# EAGLE design elatus (EAGLE 6.1)
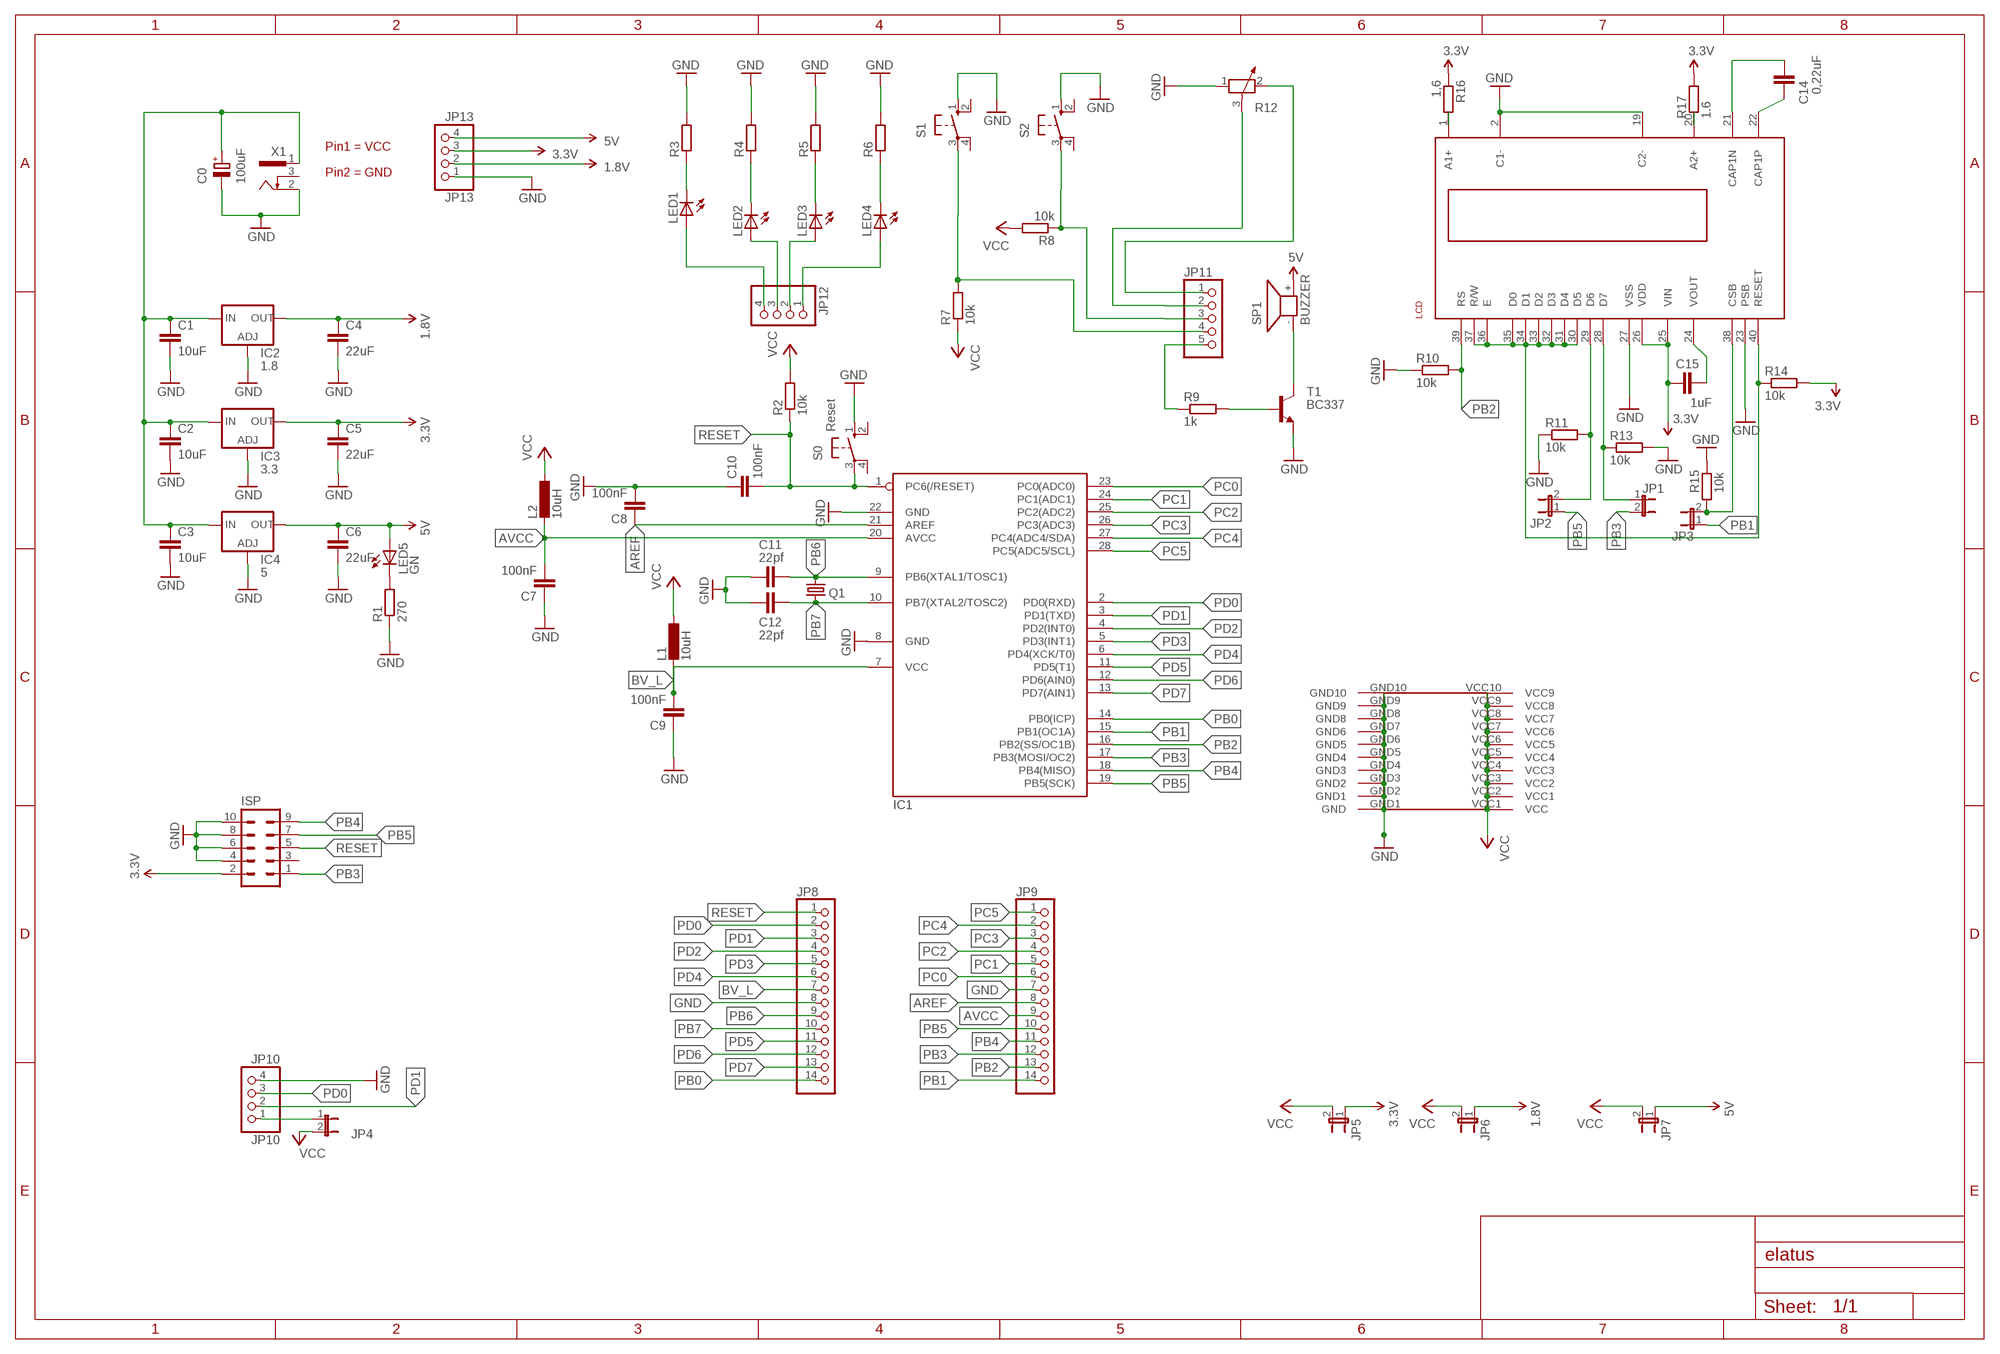
[diagram p0: schematic, sheet 1]

## Parts
C0  100uF  RCL_CPOL-EUE2.5-7  [RCL_E2,5-7]
C1  10uF  RCL_C-EU025-040X050  [RCL_C025-040X050]
C2  10uF  RCL_C-EU025-040X050  [RCL_C025-040X050]
C3  10uF  RCL_C-EU025-040X050  [RCL_C025-040X050]
C4  22uF  RCL_C-EU025-040X050  [RCL_C025-040X050]
C5  22uF  RCL_C-EU025-040X050  [RCL_C025-040X050]
C6  22uF  RCL_C-EU025-040X050  [RCL_C025-040X050]
C7  100nF  RCL_C-EU025-040X050  [RCL_C025-040X050]
C8  100nF  RCL_C-EU025-040X050  [RCL_C025-040X050]
C9  100nF  RCL_C-EU025-040X050  [RCL_C025-040X050]
C10  100nF  RCL_C-EU025-040X050  [RCL_C025-040X050]
C11  22pf  RESISTOR_C-EU050-024X044  [RESISTOR_C050-024X044]
C12  22pf  RESISTOR_C-EU050-024X044  [RESISTOR_C050-024X044]
C14  0,22uF  RCL_C-EU025-040X050  [RCL_C025-040X050]
C15  1uF  RCL_C-EU025-040X050  [RCL_C025-040X050]
IC1  MEGA8-P  [DIL28-3]
IC2  1.8  LM1117T-ADJ-V  [TO220V]
IC3  3.3  LM1117T-ADJ-V  [TO220V]
IC4  5  LM1117T-ADJ-V  [TO220V]
ISP  CON-HARTING-ML_ML10  [CON-HARTING-ML_ML10]
JP1  JP1E  [JP1]
JP2  JP1E  [JP1]
JP3  JP1E  [JP1]
JP4  JP1E  [JP1]
JP5  JP1E  [JP1]
JP6  JP1E  [JP1]
JP7  JP1E  [JP1]
JP8  PINHD-1X14  [1X14]
JP9  PINHD-1X14  [1X14]
JP10  JP10  PINHD-1X4  [1X04]
JP11  PINHD-1X5  [1X05]
JP12  PINHD-1X4  [1X04]
JP13  JP13  PINHD-1X4  [1X04]
L1  10uH  RCL_L-EU2200-12.7  [RCL_2200-12.7]
L2  10uH  RCL_L-EU2200-12.7  [RCL_2200-12.7]
LCD  -OPTO_DOGM  [-OPTO_DOGM]
LED1  LED_LED3MM  [LED_LED3MM]
LED2  LED_LED3MM  [LED_LED3MM]
LED3  LED_LED3MM  [LED_LED3MM]
LED4  LED_LED3MM  [LED_LED3MM]
LED5  GN  LED_LED3MM  [LED_LED3MM]
Q1  CRYSTAL_CRYSTALHC49U70  [CRYSTAL_HC49U70]
R1  270  R-EU_0207/10  [0207/10]
R2  10k  R-EU_0207/10  [0207/10]
R3  R-EU_0207/10  [0207/10]
R4  R-EU_0207/10  [0207/10]
R5  R-EU_0207/10  [0207/10]
R6  R-EU_0207/10  [0207/10]
R7  10k  R-EU_0207/10  [0207/10]
R8  10k  R-EU_0207/10  [0207/10]
R9  1k  R-EU_0207/10  [0207/10]
R10  10k  R-EU_0207/10  [0207/10]
R11  10k  R-EU_0207/10  [0207/10]
R12  POTENTIOMETER_PT-10  [PT-10]
R13  10k  R-EU_0207/10  [0207/10]
R14  10k  R-EU_0207/10  [0207/10]
R15  10k  R-EU_0207/10  [0207/10]
R16  1,6  R-EU_0207/10  [0207/10]
R17  1.6  R-EU_0207/10  [0207/10]
S0  Reset  SWITCH-OMRON_10-XX  [SWITCH-OMRON_B3F-10XX]
S1  SWITCH-OMRON_10-XX  [SWITCH-OMRON_B3F-10XX]
S2  SWITCH-OMRON_10-XX  [SWITCH-OMRON_B3F-10XX]
SP1  BUZZER  BUZZER_F/PMX04  [BUZZER_F/PMX04A]
T1  BC337  [TO92]
U$3  JP5  RASTER_2_45  [RASTER_2_54]
X1  CON-CONRAD_733980-62  [CON-CONRAD_733980-62]

## Nets
1.8V: C4.1 IC2.2(OUT) JP6.1 JP13.2
3.3V: C5.1 C15.2 IC3.2(OUT) ISP.2 JP5.1 JP13.3 LCD.25(VIN) LCD.26(VDD) R14.2 R16.1 R17.2
5V: C6.1 IC4.2(OUT) JP7.1 JP13.4 LED5.A SP1.+
AREF: C8.1 IC1.21(AREF) JP9.8
AVCC: C7.2 IC1.20(AVCC) JP9.9 L2.2
BV_L: C9.2 IC1.7(VCC) JP8.7 L1.2
GND: C0.- C1.2 C2.2 C3.2 C4.2 C5.2 C6.2 C7.1 C8.2 C9.1 C10.1 C11.1 C12.1 IC1.8(GND) IC1.22(GND) IC2.1(ADJ) IC3.1(ADJ) IC4.1(ADJ) ISP.4 ISP.6 ISP.8 ISP.10 JP8.8 JP9.7 JP10.4 JP13.1 LCD.2(C1-) LCD.19(C2-) LCD.23(PSB) LCD.27(VSS) R1.1 R3.2 R4.2 R5.2 R6.2 R10.1 R11.1 R12.1 R13.2 R15.2 S0.1(S) S1.1(S) S2.1(S) T1.1(E) U$3.GND1(GND) U$3.GND2(GND1) U$3.GND3(GND2) U$3.GND4(GND3) U$3.GND5(GND4) U$3.GND6(GND5) U$3.GND7(GND6) U$3.GND8 U$3.GND9 U$3.GND10 X1.2
N$1: LED1.K(C) R3.1
N$3: LED2.K(C) R4.1
N$5: JP11.2 R12.3
N$7: LED3.K(C) R5.1
N$9: JP11.4 R7.2 S1.3(P)
N$10: JP12.4 LED1.A
N$11: JP11.3 R8.1 S2.3(P)
N$12: LED4.K(C) R6.1
N$13: JP11.1 R12.2
N$14: JP12.3 LED2.A
N$15: JP2.2 LCD.29(D6) R11.2
N$16: JP1.1 LCD.28(D7) R13.1
N$18: LED5.K(C) R1.2
N$20: JP4.1 JP10.1
N$21: JP12.2 LED3.A
N$22: JP11.5 R9.1
N$24: JP12.1 LED4.A
N$25: SP1.- T1.3(C)
N$27: LCD.20(A2+) R17.1
N$28: C14.2 LCD.21(CAP1N)
N$29: C14.1 LCD.22(CAP1P)
N$30 [vcc_d]: C0.+ C1.1 C2.1 C3.1 IC2.3(IN) IC3.3(IN) IC4.3(IN) X1.1
N$31: LCD.1(A1+) R16.2
N$32: LCD.30(D5) LCD.31(D4) LCD.32(D3) LCD.33(D2) LCD.34(D1) LCD.35(D0) LCD.36(E) LCD.37(R/W) LCD.40(RESET) R14.1
N$34: R9.2 T1.2(B)
N$35: C15.1 LCD.24(VOUT)
N$37: JP3.2 LCD.38(CSB) R15.1
PB0: IC1.14(PB0(ICP)) JP8.14
PB1: IC1.15(PB1(OC1A)) JP3.1 JP9.14
PB2: IC1.16(PB2(SS/OC1B)) JP9.13 LCD.39(RS) R10.2
PB3: IC1.17(PB3(MOSI/OC2)) ISP.1 JP1.2 JP9.12
PB4: IC1.18(PB4(MISO)) ISP.9 JP9.11
PB5: IC1.19(PB5(SCK)) ISP.7 JP2.1 JP9.10
PB6: C11.2 IC1.9(PB6(XTAL1/TOSC1)) JP8.9 Q1.2
PB7: C12.2 IC1.10(PB7(XTAL2/TOSC2)) JP8.10 Q1.1
PC0: IC1.23(PC0(ADC0)) JP9.6
PC1: IC1.24(PC1(ADC1)) JP9.5
PC2: IC1.25(PC2(ADC2)) JP9.4
PC3: IC1.26(PC3(ADC3)) JP9.3
PC4: IC1.27(PC4(ADC4/SDA)) JP9.2
PC5: IC1.28(PC5(ADC5/SCL)) JP9.1
PD0: IC1.2(PD0(RXD)) JP8.2 JP10.3
PD1: IC1.3(PD1(TXD)) JP8.3 JP10.2
PD2: IC1.4(PD2(INT0)) JP8.4
PD3: IC1.5(PD3(INT1)) JP8.5
PD4: IC1.6(PD4(XCK/T0)) JP8.6
PD5: IC1.11(PD5(T1)) JP8.11
PD6: IC1.12(PD6(AIN0)) JP8.12
PD7: IC1.13(PD7(AIN1)) JP8.13
RESET: C10.2 IC1.1(PC6(/RESET)) ISP.5 JP8.1 R2.1 S0.3(P)
VCC: JP4.2 JP5.2 JP6.2 JP7.2 L1.1 L2.1 R2.2 R7.1 R8.2 U$3.VCC1(VCC) U$3.VCC2(VCC1) U$3.VCC3(VCC2) U$3.VCC4(VCC3) U$3.VCC5(VCC4) U$3.VCC6(VCC5) U$3.VCC7(VCC6) U$3.VCC8(VCC7) U$3.VCC9(VCC8) U$3.VCC10(VCC9)
Unconnected: ISP.3 S0.2(S1) S0.4(P1) S1.2(S1) S1.4(P1) S2.2(S1) S2.4(P1) X1.3

## Notes on the sheet
- Pin1 = VCC
- Pin2 = GND

## Library data of the parts
C0 = CPU-k_module_Rev3.0:RCL_CPOL-EU: POLARIZED CAPACITOR, European symbol
C1-C10 C14 C15 = CPU-k_module_Rev3.0:RCL_C-EU: CAPACITOR, European symbol
C11 C12 = CPU-k_module_Rev3.0:RESISTOR_C-EU: CAPACITOR, European symbol
IC1 = atmel:MEGA8-P: MICROCONTROLLER 8 Kbytes FLASH, 1 kbytes SRAM, 512 bytes EEPROM, USART, 4-channel 10 bit ADC, 2-channel 8 bit ADC Pin compatible with Atmega48, ATMega88, ATMega168 Source: avr.lbr
IC2-IC4 = lm1117:LM1117T-ADJ
ISP = CPU-k_module_Rev3.0:CON-HARTING-ML_ML10: HARTING
JP1-JP7 = jumper:JP1E: JUMPER
JP8 JP9 = pinhead:PINHD-1X14: PIN HEADER
JP10 JP12 JP13 = pinhead:PINHD-1X4: PIN HEADER
JP11 = pinhead:PINHD-1X5: PIN HEADER
L1 L2 = CPU-k_module_Rev3.0:RCL_L-EU: INDUCTOR, European symbol
LCD = zeiterfassung:-OPTO_DOGM
LED1-LED5 = CPU-k_module_Rev3.0:LED_LED: LED OSRAM: - CHIPLED LG R971, LG N971, LY N971, LG Q971, LY Q971, LO R971, LY R971 LH N974, LH R974 LS Q976, LO Q976, LY Q976 LO Q996 - Hyper CHIPLED LW Q18S LB Q993, LB Q99A, LB R99A - SideLED LS A670, LO A670, LY A670, LG A670, LP A670 LB A673, LV A673, LT A673, LW A673 LH A674 LY A675 LS A676, LA A676, LO A676, LY A676, LW A676 LS A679, LY A679, LG A679 - Hyper Micro SIDELED® LS Y876, LA Y876, LO Y876, LY Y876 LT Y87S - SmartLED LW L88C, LW L88S LB L89C, LB L89S, LG L890 LS L89K, LO L89K, LY L89K LS L896, LA L896, LO L896, LY L896 - TOPLED LS T670, LO T670, LY T670, LG T670, LP T670 LSG T670, LSP T670, LSY T670, LOP T670, LYG T670 LG T671, LOG T671, LSG T671 LB T673, LV T673, LT T673, LW T673 LH T674 LS T676, LA T676, LO T676, LY T676, LB T676, LH T676, LSB T676, LW T676 LB T67C, LV T67C, LT T67C, LS T67K, LO T67K, LY T67K, LW E67C LS E67B, LA E67B, LO E67B, LY E67B, LB E67C, LV E67C, LT E67C LW T67C LS T679, LY T679, LG T679 LS T770, LO T770, LY T770, LG T770, LP T770 LB T773, LV T773, LT T773, LW T773 LH T774 LS E675, LA E675, LY E675, LS T675 LS T776, LA T776, LO T776, LY T776, LB T776 LHGB T686 LT T68C, LB T68C - Hyper Mini TOPLED® LB M676 - Mini TOPLED Santana® LG M470 LS M47K, LO M47K, LY M47K Source: http://www.osram.convergy.de - LUMILED® LXK2-PW12-R00, LXK2-PW12-S00, LXK2-PW14-U00, LXK2-PW14-V00 LXK2-PM12-R00, LXK2-PM12-S00, LXK2-PM14-U00 LXK2-PE12-Q00, LXK2-PE12-R00, LXK2-PE12-S00, LXK2-PE14-T00, LXK2-PE14-U00 LXK2-PB12-K00, LXK2-PB12-L00, LXK2-PB12-M00, LXK2-PB14-N00, LXK2-PB14-P00, LXK2-PB14-Q00 LXK2-PR12-L00, LXK2-PR12-M00, LXK2-PR14-Q00, LXK2-PR14-R00 LXK2-PD12-Q00, LXK2-PD12-R00, LXK2-PD12-S00 LXK2-PH12-R00, LXK2-PH12-S00 LXK2-PL12-P00, LXK2-PL12-Q00, LXK2-PL12-R00 Source: www.luxeon.com
Q1 = CPU-k_module_Rev3.0:CRYSTAL_CRYSTAL: CRYSTAL
R1-R11 R13-R17 = rcl:R-EU_: RESISTOR, European symbol
R12 = rcl:POTENTIOMETER_: Potentiometer
S0 S1 S2 = CPU-k_module_Rev3.0:SWITCH-OMRON_10-XX: OMRON SWITCH
SP1 = CPU-k_module_Rev3.0:BUZZER_F/PMX04: SPEAKER Source: Buerklin
T1 = transistor:BC337: NPN TRANSISTOR
U$3 = raster:RASTER_2_45
X1 = CPU-k_module_Rev3.0:CON-CONRAD_73398?: FEMALE PRINT CONNECTOR Niedervolt-Steckverbinder Distributor Conrad

## Net classes
0 default: width 0.2 mm, drill 0.2 mm, clearance 0.2 mm
1 vcc_d: width 0.4 mm, drill 0.2 mm, clearance 0.2 mm

## Board
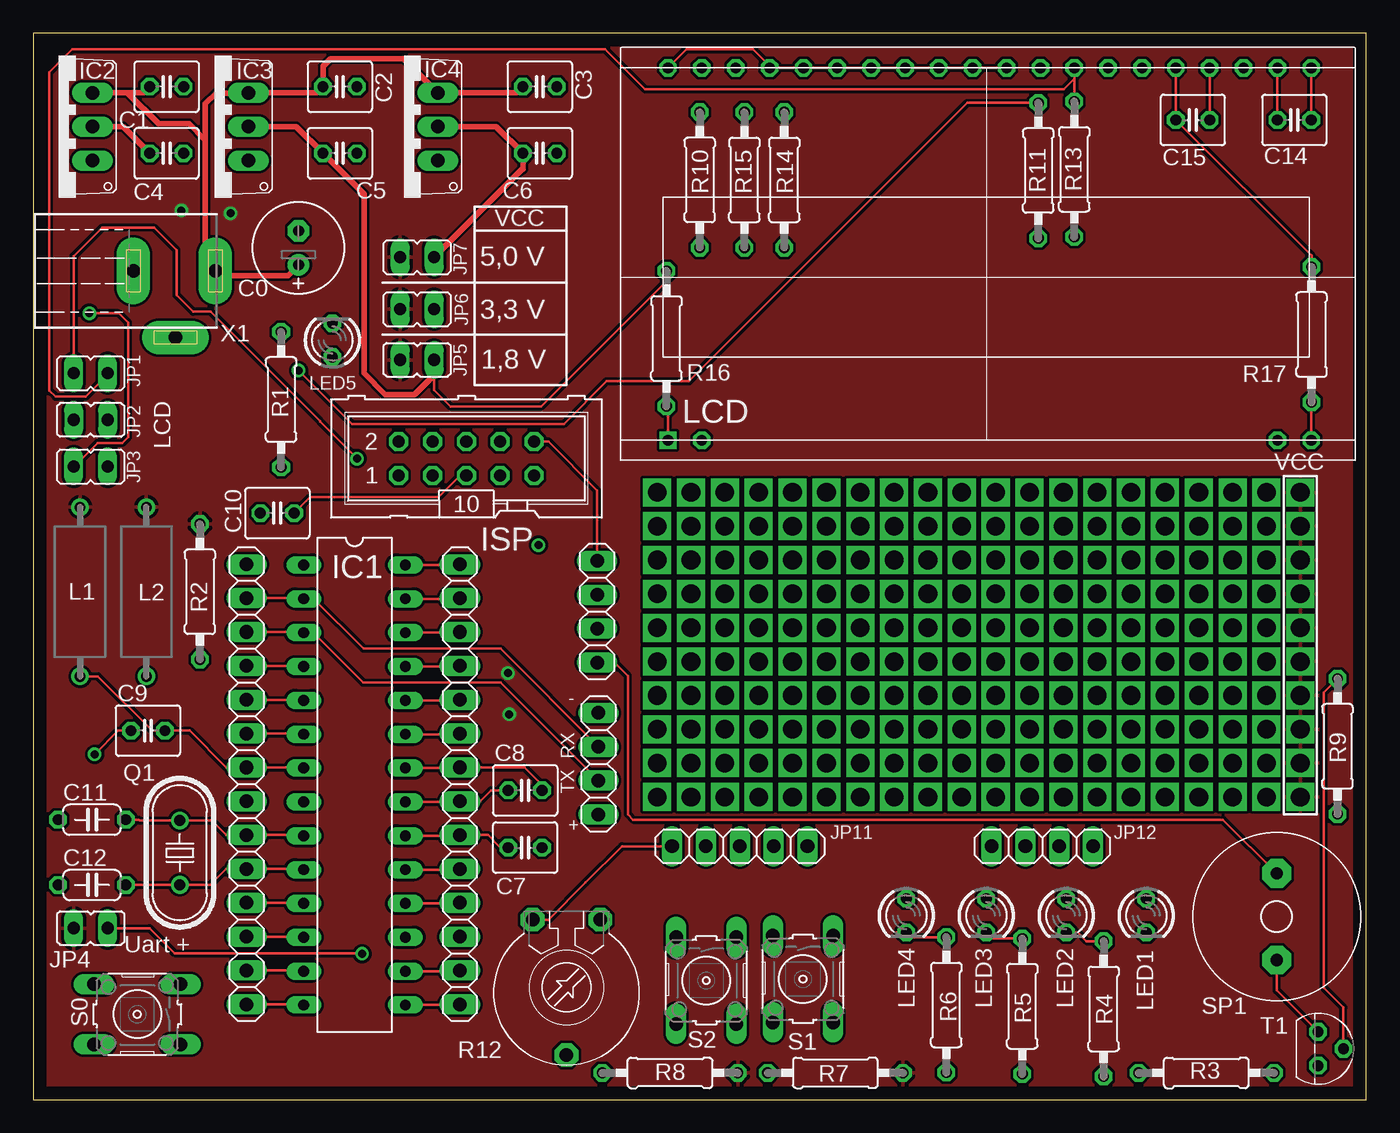
[diagram p1: board, top side]
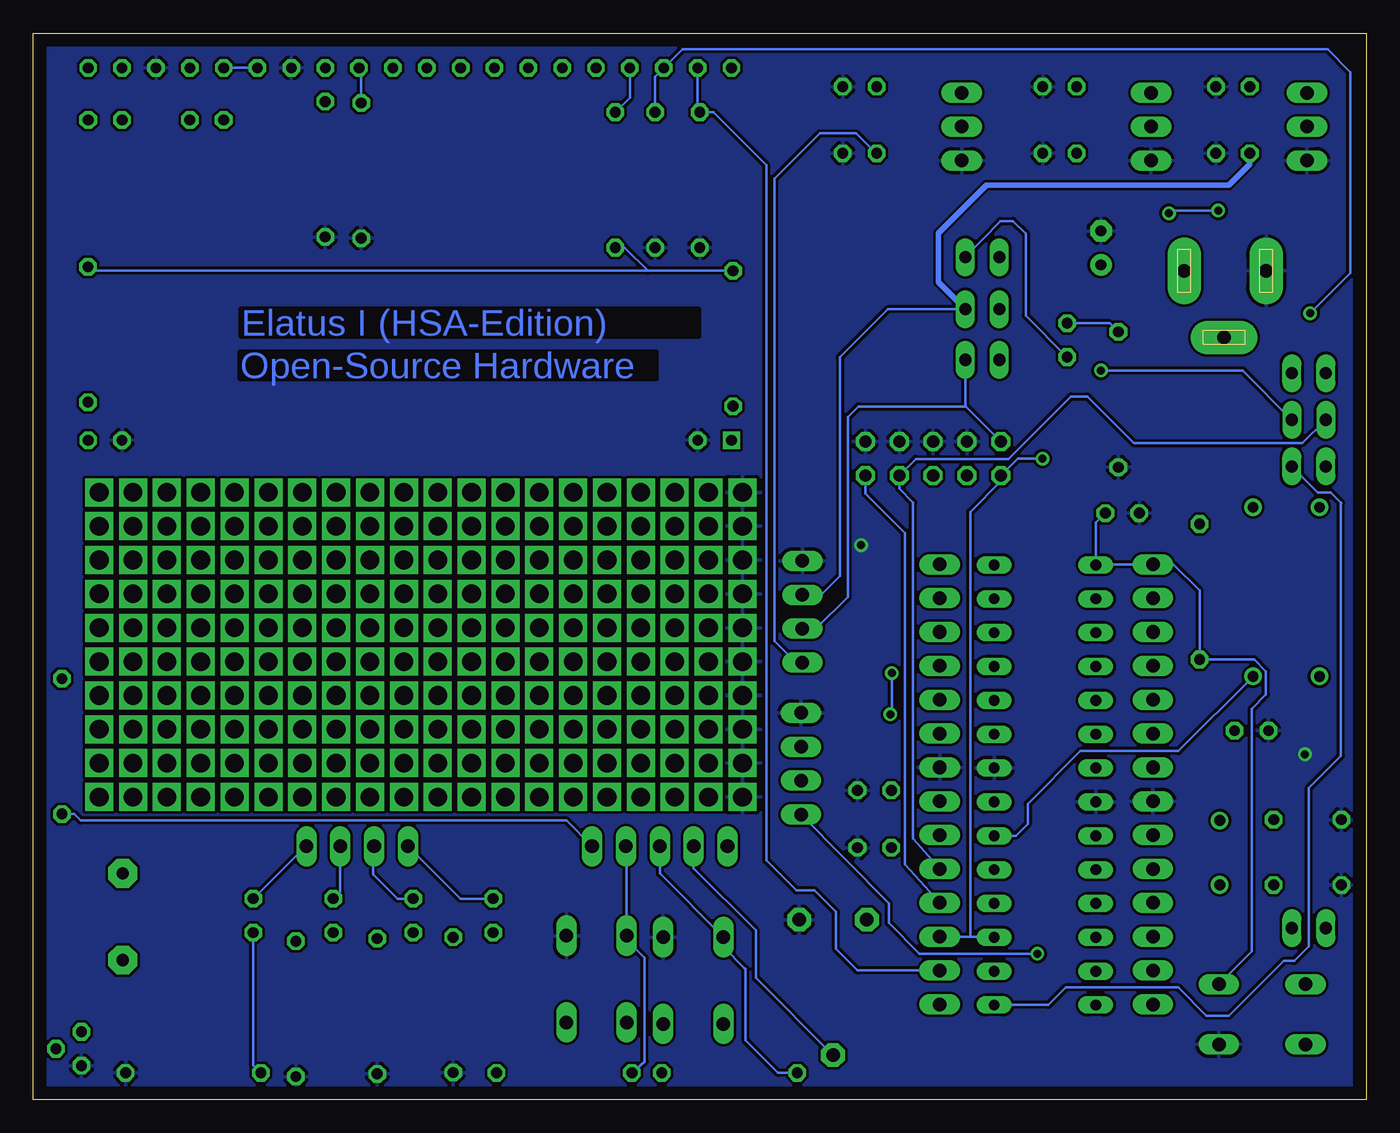
[diagram p2: board, bottom side, seen from below]

Size 100 x 80 mm. Coordinates in mm from the lower left corner, seen from the top.
Outline: 0,0 100,0 100,80 0,80 0,0
Copper layers (1*16): Top 0.035mm / dielectric 1.5mm / Bottom 0.035mm
Design rules: minimum track width 0.2mm, minimum drill 0.3mm, track to track 0.2mm, track to pad 0.2mm, pad to pad 0.2mm, via to via 0.2mm, smd to smd 0.2mm, copper to edge 1mm, drill to drill 0.2mm, minimum pad ring 10mil, minimum via ring 8mil, stop-mask expansion 4mil, vias tented up to drill 0mil, thermal gap 10mil

### Footprints (pad centres in the part's own frame; a part is rotated, then mirrored left to right if it is on the bottom)
RCL_E2,5-7 = drill 0.813 pad 1.6: + -1.27,0 | drill 0.813 pad 1.6 octagon: - 1.27,0
RCL_C025-040X050 = drill 0.813 octagon: 1 -1.27,0; 2 1.27,0
RESISTOR_C050-024X044 = drill 0.813 octagon: 1 -2.54,0; 2 2.54,0
DIL28-3 = drill 0.813 long: 1 -16.51,-3.81; 2 -13.97,-3.81; 3 -11.43,-3.81; 4 -8.89,-3.81; 5 -6.35,-3.81; 6 -3.81,-3.81; 7 -1.27,-3.81; 8 1.27,-3.81; 9 3.81,-3.81; 10 6.35,-3.81; 11 8.89,-3.81; 12 11.43,-3.81; 13 13.97,-3.81; 14 16.51,-3.81; 15 16.51,3.81; 16 13.97,3.81; 17 11.43,3.81; 18 8.89,3.81; 19 6.35,3.81; 20 3.81,3.81; 21 1.27,3.81; 22 -1.27,3.81; 23 -3.81,3.81; 24 -6.35,3.81; 25 -8.89,3.81; 26 -11.43,3.81; 27 -13.97,3.81; 28 -16.51,3.81
TO220V = drill 1.016 long: 1 -2.54,-2.54; 2 0,-2.54; 3 2.54,-2.54
CON-HARTING-ML_ML10 = drill 0.914 octagon: 1 -5.08,-1.27; 2 -5.08,1.27; 3 -2.54,-1.27; 4 -2.54,1.27; 5 0,-1.27; 6 0,1.27; 7 2.54,-1.27; 8 2.54,1.27; 9 5.08,-1.27; 10 5.08,1.27
JP1 = drill 0.914 long: 1 0,-1.27; 2 0,1.27
1X14 = drill 1.016 long: 1 -16.51,0; 2 -13.97,0; 3 -11.43,0; 4 -8.89,0; 5 -6.35,0; 6 -3.81,0; 7 -1.27,0; 8 1.27,0; 9 3.81,0; 10 6.35,0; 11 8.89,0; 12 11.43,0; 13 13.97,0; 14 16.51,0
1X04 = drill 1.016 long: 1 -3.81,0; 2 -1.27,0; 3 1.27,0; 4 3.81,0
1X05 = drill 1.016 long: 1 -5.08,0; 2 -2.54,0; 3 0,0; 4 2.54,0; 5 5.08,0
RCL_2200-12.7 = drill 0.8 pad 1.27: 1 -6.35,0; 2 6.35,0
-OPTO_DOGM = drill 0.8 square: 1 0,0 | drill 0.8 octagon: 2 2.54,0; 19 45.72,0; 20 48.26,0; 21 48.26,27.94; 22 45.72,27.94; 23 43.18,27.94; 24 40.64,27.94; 25 38.1,27.94; 26 35.56,27.94; 27 33.02,27.94; 28 30.48,27.94; 29 27.94,27.94; 30 25.4,27.94; 31 22.86,27.94; 32 20.32,27.94; 33 17.78,27.94; 34 15.24,27.94; 35 12.7,27.94; 36 10.16,27.94; 37 7.62,27.94; 38 5.08,27.94; 39 2.54,27.94; 40 0,27.94
LED_LED3MM = drill 0.813 octagon: A -1.27,0; K 1.27,0
CRYSTAL_HC49U70 = drill 0.813: 1 -2.413,0; 2 2.413,0
0207/10 = drill 0.813 octagon: 1 -5.08,0; 2 5.08,0
PT-10 = drill 1.016 pad 1.778 octagon: 1 -2.54,-5.08; 2 2.54,-5.08; 3 0,5.08
SWITCH-OMRON_B3F-10XX = drill 1.016 long: 1 -3.251,2.261; 2 3.251,2.261; 3 -3.251,-2.261; 4 3.251,-2.261
BUZZER_F/PMX04A = drill 0.914 pad 2.159 octagon: + 3.251,0; - -3.251,0
TO92 = drill 0.813 octagon: 1 1.27,0; 2 0,1.905; 3 -1.27,0
RASTER_2_54 = drill 1.4 square: GND1 0,22.86; GND2 0,20.32; GND3 0,17.78; GND4 0,15.24; GND5 0,12.7; GND6 0,10.16; GND7 0,7.62; GND8 0,5.08; GND9 0,2.54; GND10 0,0; P$1 2.54,0; P$2 5.08,0; P$3 7.62,0; P$5 10.16,0; P$7 12.7,0; P$8 15.24,0; P$9 17.78,0; P$10 20.32,0; P$11 22.86,0; P$13 2.54,2.54; P$14 5.08,2.54; P$15 7.62,2.54; P$16 10.16,2.54; P$17 12.7,2.54; P$18 15.24,2.54; P$19 17.78,2.54; P$20 20.32,2.54; P$21 22.86,2.54; P$23 2.54,5.08; P$24 5.08,5.08; P$25 7.62,5.08; P$26 10.16,5.08; P$27 12.7,5.08; P$28 15.24,5.08; P$29 17.78,5.08; P$30 20.32,5.08; P$31 22.86,5.08; P$33 2.54,7.62; P$34 5.08,7.62; P$35 7.62,7.62; P$36 10.16,7.62; P$37 12.7,7.62; P$38 15.24,7.62; P$39 17.78,7.62; P$40 20.32,7.62; P$41 22.86,7.62; P$42 25.4,0; P$43 27.94,0; P$44 30.48,0; P$45 33.02,0; P$46 35.56,0; P$47 38.1,0; P$48 40.64,0; P$49 43.18,0; P$50 45.72,0; P$52 2.54,10.16; P$53 5.08,10.16; P$54 7.62,10.16; P$55 10.16,10.16; P$56 12.7,10.16; P$57 15.24,10.16; P$58 17.78,10.16; P$59 20.32,10.16; P$60 22.86,10.16; P$62 2.54,12.7; P$63 5.08,12.7; P$64 7.62,12.7; P$65 10.16,12.7; P$66 12.7,12.7; P$67 15.24,12.7; P$68 17.78,12.7; P$69 20.32,12.7; P$70 22.86,12.7; P$72 2.54,15.24; P$73 5.08,15.24; P$74 7.62,15.24; P$75 10.16,15.24; P$76 12.7,15.24; P$77 15.24,15.24; P$78 17.78,15.24; P$79 20.32,15.24; P$80 22.86,15.24; P$82 2.54,17.78; P$83 5.08,17.78; P$84 7.62,17.78; P$85 10.16,17.78; P$86 12.7,17.78; P$87 15.24,17.78; P$88 17.78,17.78; P$89 20.32,17.78; P$90 22.86,17.78; P$92 2.54,20.32; P$93 5.08,20.32; P$94 7.62,20.32; P$95 10.16,20.32; P$96 12.7,20.32; P$97 15.24,20.32; P$98 17.78,20.32; P$99 20.32,20.32; P$100 22.86,20.32; P$102 2.54,22.86; P$103 5.08,22.86; P$104 7.62,22.86; P$105 10.16,22.86; P$106 12.7,22.86; P$107 15.24,22.86; P$108 17.78,22.86; P$109 20.32,22.86; P$110 22.86,22.86; P$112 25.4,2.54; P$113 27.94,2.54; P$114 30.48,2.54; P$115 33.02,2.54; P$116 35.56,2.54; P$117 38.1,2.54; P$118 40.64,2.54; P$119 43.18,2.54; P$120 45.72,2.54; P$122 25.4,5.08; P$123 27.94,5.08; P$124 30.48,5.08; P$125 33.02,5.08; P$126 35.56,5.08; P$127 38.1,5.08; P$128 40.64,5.08; P$129 43.18,5.08; P$130 45.72,5.08; P$132 25.4,7.62; P$133 27.94,7.62; P$134 30.48,7.62; P$135 33.02,7.62; P$136 35.56,7.62; P$137 38.1,7.62; P$138 40.64,7.62; P$139 43.18,7.62; P$140 45.72,7.62; P$142 25.4,10.16; P$143 27.94,10.16; P$144 30.48,10.16; P$145 33.02,10.16; P$146 35.56,10.16; P$147 38.1,10.16; P$148 40.64,10.16; P$149 43.18,10.16; P$150 45.72,10.16; P$152 25.4,12.7; P$153 27.94,12.7; P$154 30.48,12.7; P$155 33.02,12.7; P$156 35.56,12.7; P$157 38.1,12.7; P$158 40.64,12.7; P$159 43.18,12.7; P$160 45.72,12.7; P$162 25.4,15.24; P$163 27.94,15.24; P$164 30.48,15.24; P$165 33.02,15.24; P$166 35.56,15.24; P$167 38.1,15.24; P$168 40.64,15.24; P$169 43.18,15.24; P$170 45.72,15.24; P$172 25.4,17.78; P$173 27.94,17.78; P$174 30.48,17.78; P$175 33.02,17.78; P$176 35.56,17.78; P$177 38.1,17.78; P$178 40.64,17.78; P$179 43.18,17.78; P$180 45.72,17.78; P$182 25.4,20.32; P$183 27.94,20.32; P$184 30.48,20.32; P$185 33.02,20.32; P$186 35.56,20.32; P$187 38.1,20.32; P$188 40.64,20.32; P$189 43.18,20.32; P$190 45.72,20.32; P$192 25.4,22.86; P$193 27.94,22.86; P$194 30.48,22.86; P$195 33.02,22.86; P$196 35.56,22.86; P$197 38.1,22.86; P$198 40.64,22.86; P$199 43.18,22.86; P$200 45.72,22.86; VCC1 48.26,22.86; VCC2 48.26,20.32; VCC3 48.26,17.78; VCC4 48.26,15.24; VCC5 48.26,12.7; VCC6 48.26,10.16; VCC7 48.26,7.62; VCC8 48.26,5.08; VCC9 48.26,2.54; VCC10 48.26,0
CON-CONRAD_733980-62 = drill 1 pad 2.5 long: 1 0,8.57; 2 0,2.42; 3 5,5.57

### Placement (x,y rotation side)
C0  19.9,63.9 90 top
C1  10,76 0 top
C2  23,76 0 top
C3  38,76 0 top
C4  10,71 0 top
C5  23,71 0 top
C6  38,71 0 top
C7  36.9,18.9 180 top
C8  36.9,23.2 0 top
C9  8.6,27.68 0 top
C10  18.3,44 0 top
C11  4.4,21 0 top
C12  4.4,16.1 0 top
C14  94.61,73.5 0 top
C15  86.99,73.5 180 top
IC1  24.1,23.6 270 top
IC2  1.9,73 90 top
IC3  13.6,73 90 top
IC4  27.8,73 90 top
ISP  32.49,48.1 0 top
JP1  4.3,54.5 90 top
JP2  4.3,51 270 top
JP3  4.3,47.5 90 top
JP4  4.3,12.86 90 top
JP5  28.8,55.5 90 top
JP6  28.8,59.3 90 top
JP7  28.8,63.2 90 top
JP8  16,23.65 270 top
JP9  32,23.65 270 top
JP10  42.4,25.2 90 top
JP11  53,19 0 top
JP12  75.7,19 0 top
JP13  42.3,36.6 270 top
L1  3.51,38.1 270 top
L2  8.48,38.1 270 top
LCD  47.62,49.47 0 top
LED1  83.5,13.8 270 top
LED2  77.5,13.8 270 top
LED3  71.5,13.8 270 top
LED4  65.5,13.8 270 top
LED5  22.44,56.98 90 top
Q1  10.99,18.52 90 top
R1  18.59,52.52 90 top
R2  12.5,38.1 90 top
R3  88,2 0 top
R4  80.3,6.8 270 top
R5  74.2,7 270 top
R6  68.5,7.1 270 top
R7  60.17,2 180 top
R8  47.77,2 0 top
R9  97.85,26.5 90 top
R10  50,69 90 top
R11  75.4,69.7 90 top
R12  40,8.41 180 top
R13  78.1,69.8 270 top
R14  56.34,69 270 top
R15  53.35,69 270 top
R16  47.5,57.1 270 top
R17  95.9,57.4 90 top
S0  7.8,6.4 180 top
S1  57.74,9.04 270 top
S2  50.49,8.93 270 top
SP1  93.29,13.72 90 top
T1  96.39,3.81 270 top
U$3  46.8,22.7 0 top
X1  5.09,62.18 270 top

### Tracks (layer width: path | path; a pad name or v marks a point on that pad's centre or on a via)
1.8V
  Top 0.4: IC2.2 6.73,73 C4.1
  Bottom 0.2: JP6.1 35.9,59.3 39.5,55.7 39.5,39.27 40.9,37.87 JP13.2
  Bottom 0.4: JP6.1 32.1,61.33 32.1,65 28.5,68.6 10.3,68.6 8.73,70.17 C4.1
3.3V
  Top 0.2: R17.2 95.9,63.32 C15.2 LCD.25 | 30.07,55 30.07,53.23 31.3,52 38.1,52 47.5,61.4 R16.1
  Top 0.4: IC3.2 19.73,73 C5.1 24.8,67.93 24.8,54.5 26.4,52.9 28.6,52.9 30.07,54.37 30.07,55 JP5.1
  Bottom 0.2: JP5.1 30.07,52.03 ISP.2 30.04,52 38.1,52 38.9,51.2 38.9,37.7 41.27,35.33 JP13.3 | R16.1 53.9,62.18 | 53.9,62.18 95.6,62.18 R17.2 | R14.2 55.64,63.92 53.9,62.18 | LCD.26 LCD.25
5V
  Top 0.2: SP1.+ 89.26,21 45,21 44.6,21.4 44.6,31.8 43.61,32.79 JP13.4
  Top 0.4: IC4.2 34.73,73 C6.1 36.73,69.8 36.67,69.8 JP7.1
  Bottom 0.2: 36.8,71 38.3,72.5 41,72.5 44.4,69.1 44.4,34.39 42.8,32.79 JP13.4 | JP7.1 27.46,65.91 26.49,65.91 25.55,64.97 25.55,58.82 LED5.A
  Bottom 0.4: 36.8,71 C6.1
AREF
  Top 0.2: C8.1 34.34,23.2 33.52,22.38 JP9.8 31.65,22.33 IC1.21
AVCC
  Top 0.2: C7.2 35.07,18.9 34.13,19.84 JP9.9 31.65,19.79 IC1.20
  Bottom 0.2: IC1.20 26.29,19.79 25.4,20.68 25.4,22.2 21.46,26.14 14.09,26.14 L2.2
BV_L
  Top 0.2: L1.2 4.84,31.75 8.91,27.68 C9.2 11.72,27.68 14.48,24.92 JP8.7 20.24,24.92 IC1.7
GND  (via drill 0.6)
  Top 0.2: v4.6,25.9 6.38,27.68 C9.1 | ISP.10 38.64,49.37 42.3,45.71 JP13.1 | IC1.22 31.65,24.87 JP9.7 36.85,24.92 38.17,23.6 C8.2
  other vias: 37.9,41.6
  pour Bottom: -3.88,84.24 102.35,83.6 102.78,-3.06 -3.62,-3.36
N$1
  Bottom 0.2: LED1.K 83.5,2.58 R3.1
N$3
  Top 0.2: LED2.K 78.36,12.53 79.01,11.88 R4.1
N$5
  Bottom 0.2: R12.3 45.79,9.12 45.79,12.69 50.46,17.36 JP11.2
N$7
  Top 0.2: LED3.K 71.56,12.53 72.01,12.08 R5.1
N$9
  Bottom 0.2: JP11.4 55.48,18.94 55.48,12.78 | 55.48,12.78 S1.3 | R7.2 54.14,2.84 54.14,10.63 55.48,11.97 55.48,12.78
N$10
  Bottom 0.2: JP12.4 79.57,19 LED1.A
N$11
  Bottom 0.2: JP11.3 53,16.95 S2.3 48.23,11.46 46.63,9.86 46.56,9.79 46.56,4.43 44.13,2 R8.1
N$12
  Top 0.2: LED4.K 64.76,12.53 65.11,12.18 R6.1
N$13
  Top 0.2: R12.2 38.65,13.49 41.44,16.28 44.16,19 JP11.1
N$14
  Bottom 0.2: JP12.3 76.97,15.6 LED2.A
N$15  (via drill 0.6)
  Top 0.2: 75.56,74.94 R11.2 70.08,74.78 49.2,53.9 43,53.9 39.8,50.7 23.9,50.7 v19.9,54.7
  Bottom 0.2: LCD.29 75.4,77.25 R11.2 | v19.9,54.7 9.27,54.7 JP2.2
N$16
  Top 0.2: R13.1 LCD.28 78.1,76.6 77.3,75.8 45.9,75.8 42.9,78.8 2.9,78.8 1.2,77.1 1.2,53.2 1.67,52.73 3.92,52.73 5.57,54.38 JP1.1 5.57,54.37
N$18
  Bottom 0.2: R1.2 19.24,58.25 LED5.K
N$20  (via drill 0.6)
  Top 0.2: v24.67,10.94 24.64,10.97 10.62,10.97 8.73,12.86 JP4.1
  Bottom 0.2: v24.67,10.94 33.52,10.94 35.82,13.24 35.82,14.71 JP10.1
N$21
  Bottom 0.2: LED3.A 72.67,15.07 74.5,16.9 74.5,18.93 JP12.2
N$22
  Bottom 0.2: JP11.5 60.01,20.93 96.45,20.93 96.94,21.42 R9.1
N$24
  Bottom 0.2: LED4.A 67.96,15.07 JP12.1
N$25
  Top 0.2: SP1.- 93.29,8.18 T1.3
N$27
  Top 0.2: R17.1 95.88,52.3 LCD.20
N$28
  Top 0.2: C14.2 LCD.21
N$29
  Top 0.2: C14.1 LCD.22
N$30
  Top 0.4: C3.1 36.27,75.54 IC4.3 27.78,78.1 22.3,78.1 21.73,77.53 C2.1 21.27,75.54 IC3.3 16.1,75.5 13.7,75.5 12.9,74.7 12.9,72 | 12.9,72 11.7,73.2 9.4,73.2 7.06,75.54 | 12.9,72 12.9,62.97 X1.1 14.01,61.83 19.1,61.83 C0.+ | 7.06,75.54 IC2.3 | 7.06,75.54 8.27,75.54 C1.1
N$31
  Top 0.2: R16.2 47.62,51.9 LCD.1
N$32
  Top 0.2: LCD.36 57.7,77.33 | LCD.40 49.01,78.8 54,78.8 55.24,77.56 LCD.37 LCD.36 | LCD.36 LCD.35 LCD.34 LCD.33 LCD.32 LCD.31 LCD.30
  Bottom 0.2: LCD.37 55.24,75.18 R14.1
N$34
  Top 0.2: R9.2 96.8,30.53 96.8,8.4 98.3,6.91 T1.2
N$35
  Top 0.2: C15.1 LCD.24
N$37  (via drill 0.6)
  Top 0.2: JP3.2 3.06,47.5 4.83,49.26 6.67,49.26 7.1,49.7 7.1,58.3 6.4,59 v4.2,59
  Bottom 0.2: R15.1 53.35,76.76 LCD.38 51.31,78.8 2.9,78.8 1.2,77.1 1.2,62 v4.2,59
PB0
  Top 0.2: JP8.14 20.24,7.14 IC1.14
PB1
  Top 0.2: IC1.15 31.65,7.09 JP9.14
  Bottom 0.2: 1.9,44.79 1.88,44.77 | JP3.1 3.63,45.56 2.67,45.56 1.9,44.79 | 1.9,44.79 1.9,25.8 4.3,23.4 4.3,11.5 5.4,10.4 6.2,10.4 10.3,6.3 12,6.3 14.11,8.41 22.53,8.41 23.85,7.09 IC1.15
PB2
  Top 0.2: IC1.16 31.65,9.63 JP9.13
  Bottom 0.2: LCD.39 50.16,74.24 R10.2 48.98,74.08 45,70.1 45,22.84 45.01,22.83 45.01,17.94 42.75,15.68 41.38,15.68 39.77,14.07 39.77,11.29 38.16,9.68 JP9.13 31.84,9.68
PB3  (via drill 0.6)
  Top 0.2: JP1.2 3.03,63.29 5.15,65.41 9.07,65.41 10.74,63.74 10.74,60.35 11.98,59.11 13.29,59.11 21.5,50.9 21.5,50.88 v24.29,48.09
  Bottom 0.2: v24.29,48.09 26.15,48.09 ISP.1 27.41,46.39 29.7,44.1 29.7,12.22 | IC1.17 27.96,12.22 29.7,12.22 | 29.7,12.22 JP9.12
PB4
  Top 0.2: IC1.18 31.65,14.71 JP9.11
  Bottom 0.2: JP9.11 34.6,17.66 34.6,42.5 37.57,45.47 ISP.9
PB5
  Top 0.2: IC1.19 31.65,17.25 JP9.10
  Bottom 0.2: JP9.10 34,19.6 34,44.8 35.03,45.83 ISP.7 33.8,48.06 26.85,48.06 22.15,52.76 20.92,52.76 17.42,49.25 4.78,49.26 JP2.1
PB6
  Top 0.2: C11.2 7.9,21 7.97,20.93 Q1.2 13.38,20.93 14.48,19.84 JP8.9 20.24,19.84 IC1.9
PB7
  Top 0.2: C12.2 7.5,16.1 7.51,16.11 Q1.1 13.28,16.11 14.48,17.3 JP8.10 20.24,17.3 IC1.10
PC0
  Top 0.2: IC1.23 31.65,27.41 JP9.6
PC1
  Top 0.2: IC1.24 31.65,29.95 JP9.5
PC2
  Top 0.2: IC1.25 31.65,32.49 JP9.4
PC3
  Top 0.2: IC1.26 31.65,35.03 JP9.3
PC4
  Top 0.2: IC1.27 31.65,37.57 JP9.2
PC5
  Top 0.2: IC1.28 31.65,40.11 JP9.1
PD0
  Top 0.2: JP8.2 20.24,37.62 IC1.2 21.03,37.57 24.77,33.83 35.04,33.83 JP10.3
PD1
  Top 0.2: JP8.3 20.24,35.08 IC1.3 20.99,35.03 24.73,31.29 35.04,31.29 JP10.2
PD2
  Top 0.2: JP8.4 20.24,32.54 IC1.4
PD3
  Top 0.2: JP8.5 20.24,30 IC1.5
PD4
  Top 0.2: JP8.6 20.24,27.46 IC1.6
PD5
  Top 0.2: JP8.11 20.24,14.76 IC1.11
PD6
  Top 0.2: JP8.12 20.24,12.22 IC1.12
PD7
  Top 0.2: JP8.13 20.24,9.68 IC1.13
RESET
  Top 0.2: C10.2 20.77,45.2 30.4,45.2 32.03,46.83 ISP.5
  Bottom 0.2: S0.3 8.6,11.11 8.6,29.32 7.52,30.41 7.52,32.14 8.4,33.02 R2.1 12.5,38.18 14.48,40.16 JP8.1 20.24,40.16 IC1.1 20.29,43.28 C10.2
VCC  (via drill 0.6)
  Bottom 0.2: v35.6,32 35.6,29 v35.7,28.9 | v11.1,66.7 14.6,66.7 v14.8,66.5
  pour Top: -1.63,81.78 101.48,82.52 100.93,-0.86 -1.49,-1.76

### Text on the board
Bottom: Elatus I (HSA-Edition) | Open-Source Hardware
tPlace: VCC | 5,0 V | 3,3 V | 1,8 V | LCD | VCC | - | RX | TX | + | Uart +
Document: POWER | GND | 4 | GND | 1,8 V | 3,3 V | 5 V | 1 | 4 | 5 | 4 | P | PW | S2 | S1 | SP | 1 | 1 | Open-Source Hardware | Elatus I (HSA-Edition) | http://code.google.com/p/hsa-embedded/